# EAGLE design mainboard (EAGLE 6.1)
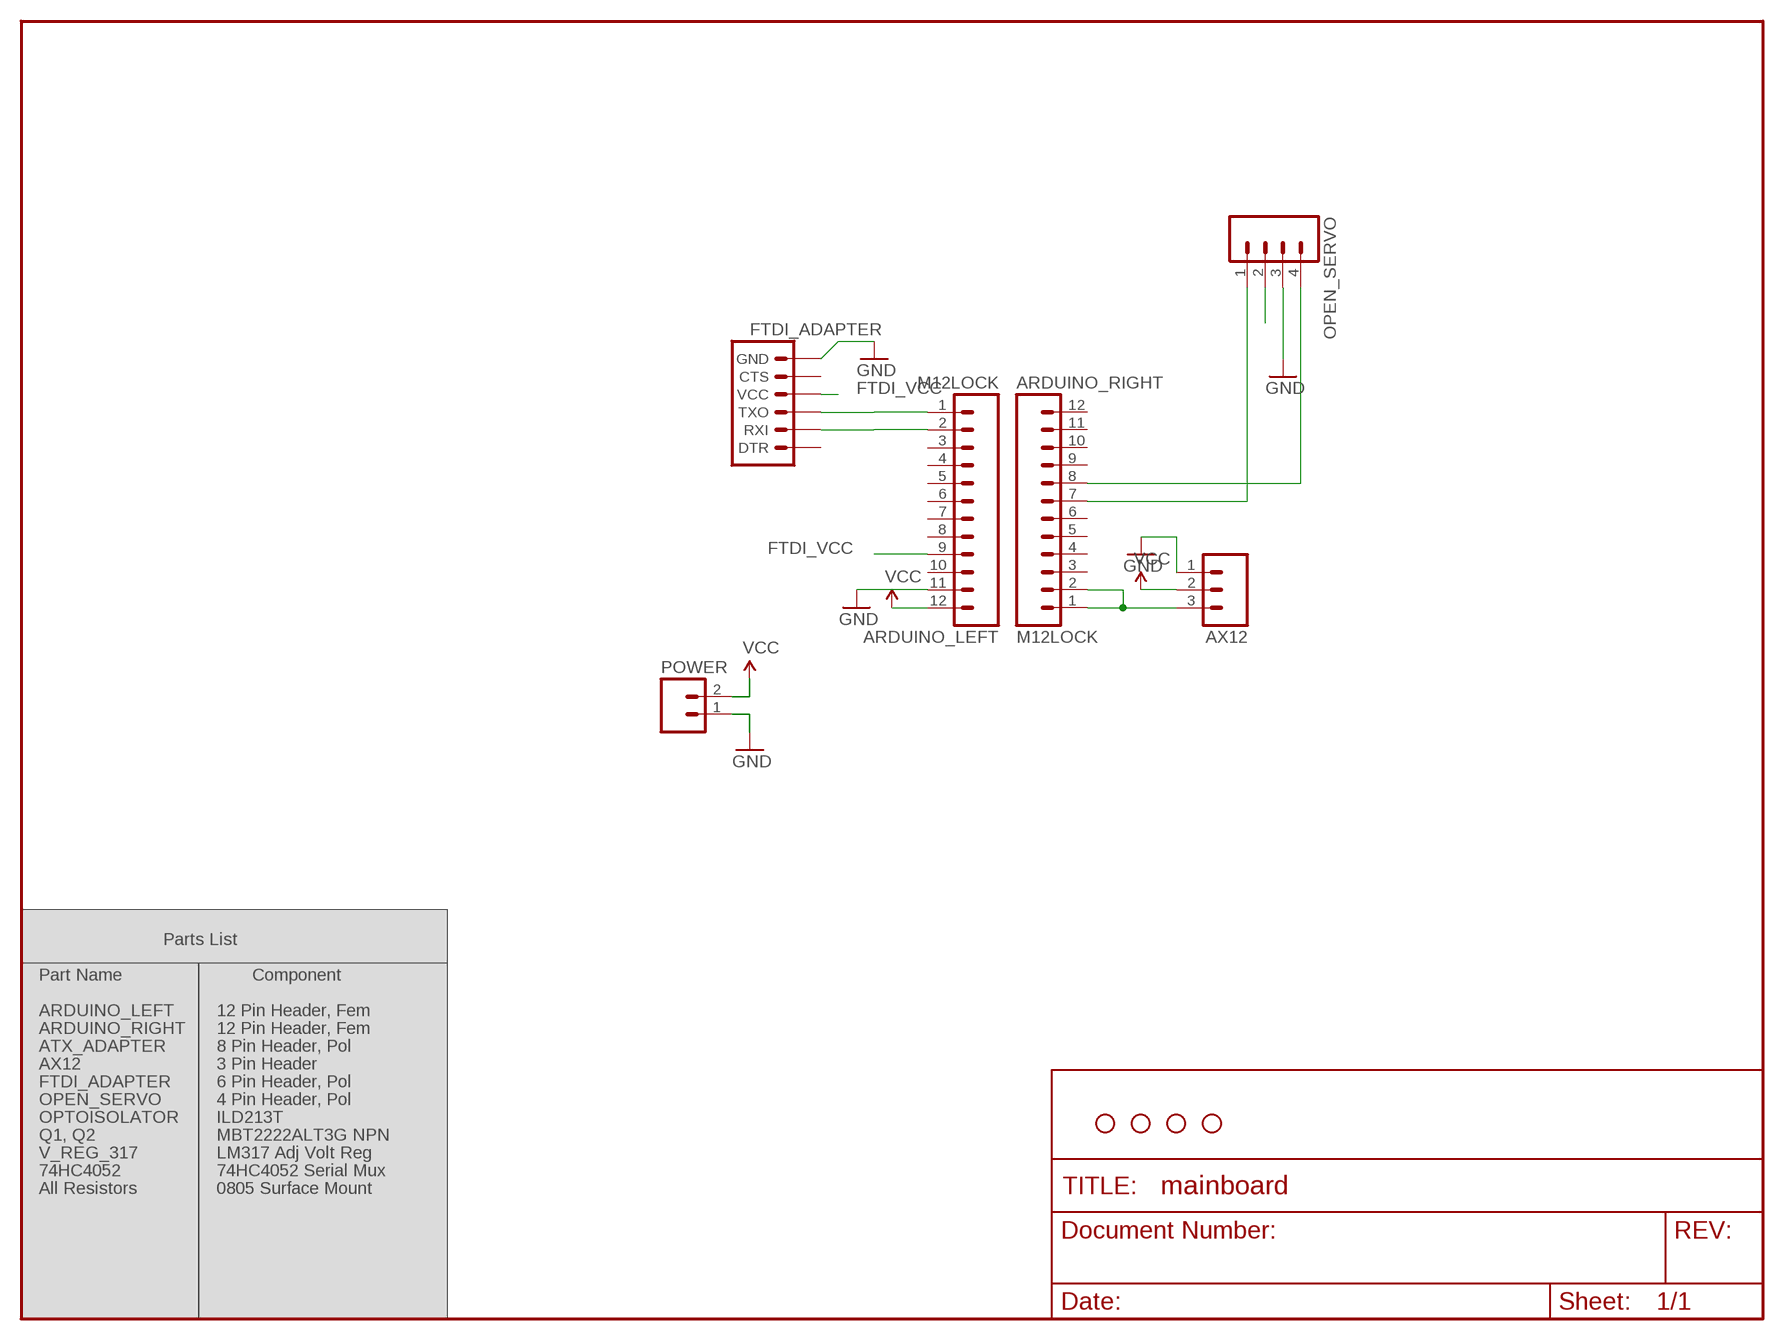
[diagram p0: schematic, sheet 1]

## Parts
ARDUINO_LEFT  M12LOCK  [1X12_LOCK]
ARDUINO_RIGHT  M12LOCK  [1X12_LOCK]
AX12  M03LOCK  [1X03_LOCK]
FTDI_ADAPTER  ARDUINO_SERIAL_PROGRAMLOCK  [1X06_LOCK]
JP1  STAND-OFF  [STAND-OFF]
JP2  STAND-OFF  [STAND-OFF]
JP3  STAND-OFF  [STAND-OFF]
JP4  STAND-OFF  [STAND-OFF]
OPEN_SERVO  M04LOCK  [1X04_LOCK]
POWER  M023.5MM  [SCREWTERMINAL-3.5MM-2]

## Nets
AX_DATA: ARDUINO_RIGHT.1 ARDUINO_RIGHT.2 AX12.3
FTDI_RX: ARDUINO_LEFT.2 FTDI_ADAPTER.2(RXI)
FTDI_TX: ARDUINO_LEFT.1 FTDI_ADAPTER.3(TXO)
FTDI_VCC: ARDUINO_LEFT.9 FTDI_ADAPTER.4(VCC)
GND: ARDUINO_LEFT.11 AX12.1 FTDI_ADAPTER.6(GND) OPEN_SERVO.3 POWER.1
N$3: OPEN_SERVO.2
N$8: ARDUINO_RIGHT.7 OPEN_SERVO.1
N$12: ARDUINO_RIGHT.8 OPEN_SERVO.4
VCC: ARDUINO_LEFT.12 AX12.2 POWER.2
Unconnected: ARDUINO_LEFT.3 ARDUINO_LEFT.4 ARDUINO_LEFT.5 ARDUINO_LEFT.6 ARDUINO_LEFT.7 ARDUINO_LEFT.8 ARDUINO_LEFT.10 ARDUINO_RIGHT.3 ARDUINO_RIGHT.4 ARDUINO_RIGHT.5 ARDUINO_RIGHT.6 ARDUINO_RIGHT.9 ARDUINO_RIGHT.10 ARDUINO_RIGHT.11 ARDUINO_RIGHT.12 FTDI_ADAPTER.1(DTR) FTDI_ADAPTER.5(CTS)

## Notes on the sheet
- Parts List
- Part Name | Component
- ARDUINO_LEFT | 12 Pin Header, Fem
- ARDUINO_RIGHT | 12 Pin Header, Fem
- ATX_ADAPTER | 8 Pin Header, Pol
- AX12 | 3 Pin Header
- FTDI_ADAPTER | 6 Pin Header, Pol
- OPEN_SERVO | 4 Pin Header, Pol
- OPTOISOLATOR | ILD213T
- Q1, Q2 | MBT2222ALT3G NPN
- V_REG_317 | LM317 Adj Volt Reg
- 74HC4052 | 74HC4052 Serial Mux
- All Resistors | 0805 Surface Mount

## Library data of the parts
ARDUINO_LEFT ARDUINO_RIGHT = SparkFun:M12: Header 12 Standard 12-pin 0.1" header. Use with straight break away headers (SKU : PRT-00116), right angle break away headers (PRT-00553), swiss pins (PRT-00743), machine pins (PRT-00117), and female headers (PRT-00115).
AX12 = SparkFun:M03: Header 3 Standard 3-pin 0.1" header. Use with straight break away headers (SKU : PRT-00116), right angle break away headers (PRT-00553), swiss pins (PRT-00743), machine pins (PRT-00117), and female headers (PRT-00115). Molex polarized connector foot print use with SKU : PRT-08232 with associated crimp pins and housings.
FTDI_ADAPTER = SparkFun:ARDUINO_SERIAL_PROGRAM
JP1-JP4 = SparkFun:STAND-OFF: Stand Off This is the mechanical footprint for a #4 phillips button head screw. Use the keepout ring to avoid running the screw head into surrounding components. SKU : PRT-00447
OPEN_SERVO = SparkFun:M04: Header 4 Standard 4-pin 0.1" header. Use with straight break away headers (SKU : PRT-00116), right angle break away headers (PRT-00553), swiss pins (PRT-00743), machine pins (PRT-00117), and female headers (PRT-00115). Molex polarized connector foot print use with SKU : PRT-08231 with associated crimp pins and housings.
POWER = SparkFun-Connectors:M02: Header 2 Standard 2-pin 0.1" header. Use with straight break away headers (SKU : PRT-00116), right angle break away headers (PRT-00553), swiss pins (PRT-00743), machine pins (PRT-00117), and female headers (PRT-00115). Molex polarized connector foot print use with SKU : PRT-08233 with associated crimp pins and housings.

## Board
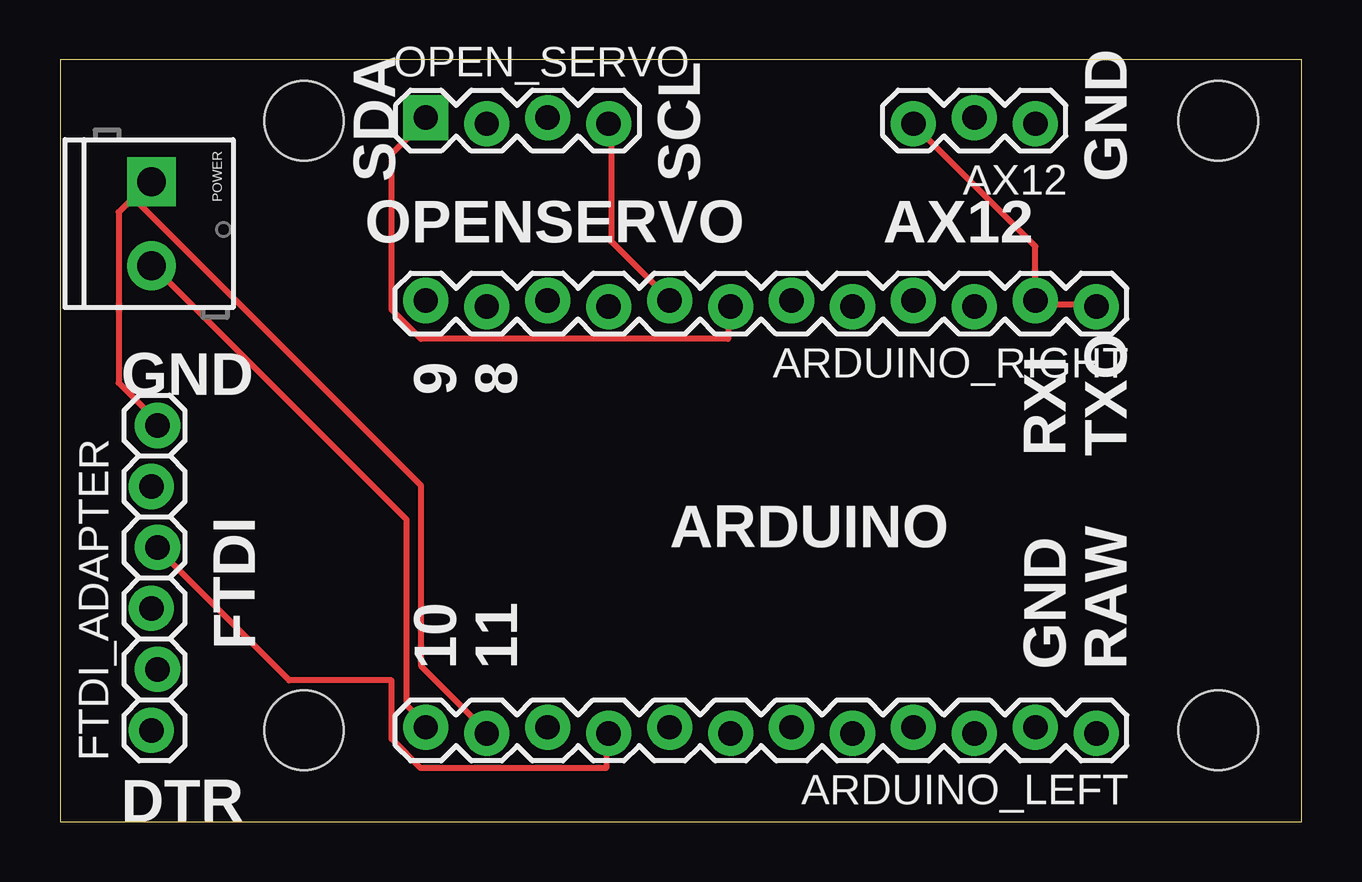
[diagram p1: board, top side]
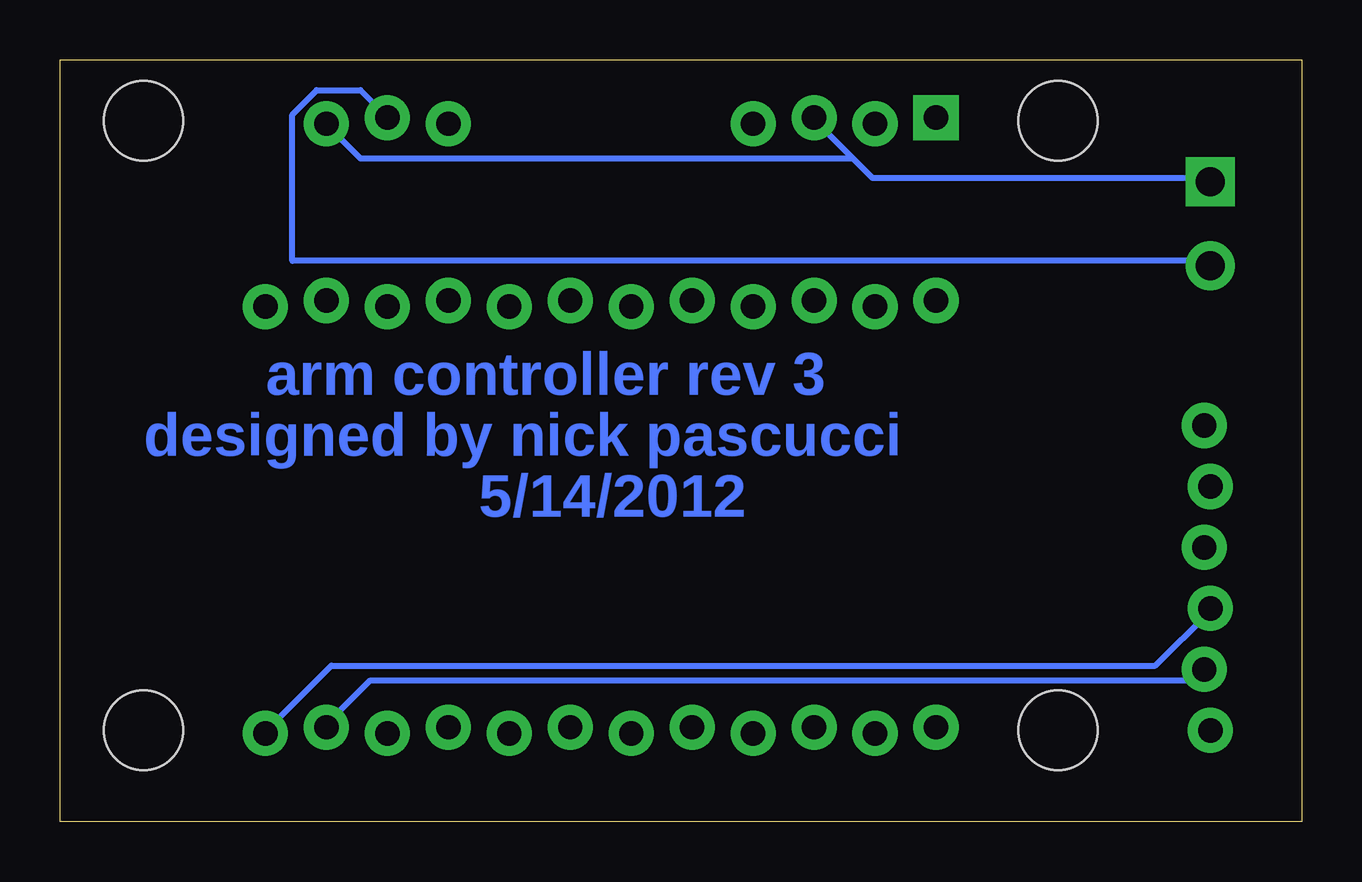
[diagram p2: board, bottom side, seen from below]

Size 51.74 x 31.74 mm. Coordinates in mm from the lower left corner, seen from the top.
Outline: 0,0 51.74,0 51.74,31.74 0,31.74 0,0
Copper layers (1*16): Top 0.035mm / dielectric 1.5mm / Bottom 0.035mm
Design rules: minimum track width 10mil, minimum drill 24mil, track to track 8mil, track to pad 8mil, pad to pad 8mil, via to via 8mil, smd to smd 8mil, copper to edge 40mil, drill to drill 8mil, minimum pad ring 10mil, minimum via ring 8mil, stop-mask expansion 4mil, vias tented up to drill 0mil, thermal gap 10mil

### Footprints (pad centres in the part's own frame; a part is rotated, then mirrored left to right if it is on the bottom)
1X12_LOCK = drill 1.016 pad 1.88: 1 0,0.127; 2 2.54,-0.127; 3 5.08,0.127; 4 7.62,-0.127; 5 10.16,0.127; 6 12.7,-0.127; 7 15.24,0.127; 8 17.78,-0.127; 9 20.32,0.127; 10 22.86,-0.127; 11 25.4,0.127; 12 27.94,-0.127
1X03_LOCK = drill 1.016 pad 1.88: 1 0,0.127; 2 2.54,-0.127; 3 5.08,0.127
1X06_LOCK = drill 1.016 pad 1.88: 1 0,0; 2 2.54,-0.254; 3 5.08,0; 4 7.62,-0.254; 5 10.16,0; 6 12.7,-0.254
STAND-OFF = hole 3.302: 0,0
1X04_LOCK = drill 1.016 pad 1.88 square: 1 0,0.127 | drill 1.016 pad 1.88: 2 2.54,-0.127; 3 5.08,0.127; 4 7.62,-0.127
SCREWTERMINAL-3.5MM-2 = drill 1.2 pad 2.032 square: 1 0,0 | drill 1.2 pad 2.032: 2 3.5,0

### Placement (x,y rotation side)
ARDUINO_LEFT  43.18,3.81 180 top
ARDUINO_RIGHT  43.18,21.59 180 top
AX12  40.64,29.21 180 top
FTDI_ADAPTER  3.81,3.81 90 top
JP1  10.16,29.21 0 top
JP2  48.26,29.21 0 top
JP3  48.26,3.81 0 top
JP4  10.16,3.81 0 top
OPEN_SERVO  15.24,29.21 0 top
POWER  3.81,26.67 270 top

### Tracks (layer width: path | path; a pad name or v marks a point on that pad's centre or on a via)
AX_DATA
  Top 0.254: ARDUINO_RIGHT.1 43.08,21.54 40.64,21.54 ARDUINO_RIGHT.2 40.64,23.98 35.56,29.06 AX12.3
FTDI_RX
  Bottom 0.254: FTDI_ADAPTER.2 4.06,6.3 4.47,5.89 38.81,5.89 40.64,4.06 ARDUINO_LEFT.2
FTDI_TX
  Bottom 0.254: FTDI_ADAPTER.3 3.86,8.74 6.1,6.5 40.44,6.5 43.08,3.86 ARDUINO_LEFT.1
FTDI_VCC
  Top 0.254: FTDI_ADAPTER.4 4.06,11.38 9.55,5.89 13.82,5.89 13.82,3.45 15.04,2.23 22.76,2.23 22.76,3.66 ARDUINO_LEFT.9
GND
  Top 0.254: 3.05,26.01 3.66,26.62 POWER.1 3.05,26.01 | 3.05,26.01 2.44,25.4 2.44,18.29 4.06,16.66 FTDI_ADAPTER.6 | 3.05,26.01 15.04,14.02 15.04,6.5 17.68,3.86 ARDUINO_LEFT.11
  Bottom 0.254: 18.69,27.64 17.88,26.82 3.86,26.82 POWER.1 | 18.69,27.64 20.32,29.26 OPEN_SERVO.3 | 18.69,27.64 39.22,27.64 40.64,29.06 AX12.1
N$8
  Top 0.254: OPEN_SERVO.1 15.24,29.26 13.82,27.84 13.82,21.34 15.04,20.12 27.84,20.12 27.84,21.34 ARDUINO_RIGHT.7
N$12
  Top 0.254: ARDUINO_RIGHT.8 25.4,21.74 22.96,24.18 22.96,29.06 OPEN_SERVO.4
VCC
  Top 0.254: ARDUINO_LEFT.12 15.24,4.06 14.43,4.88 14.43,12.6 3.86,23.16 POWER.2
  Bottom 0.254: AX12.2 38.2,29.46 39.22,30.48 41.05,30.48 42.06,29.46 42.06,23.37 3.86,23.37 POWER.2

### Text on the board
Bottom: arm controller rev 3 | designed by nick pascucci | 5/14/2012
tPlace: SDA | SCL | GND | OPENSERVO | AX12 | GND | 9 | 8 | RXI | TXO | FTDI | ARDUINO | 10 | 11 | GND | RAW | DTR